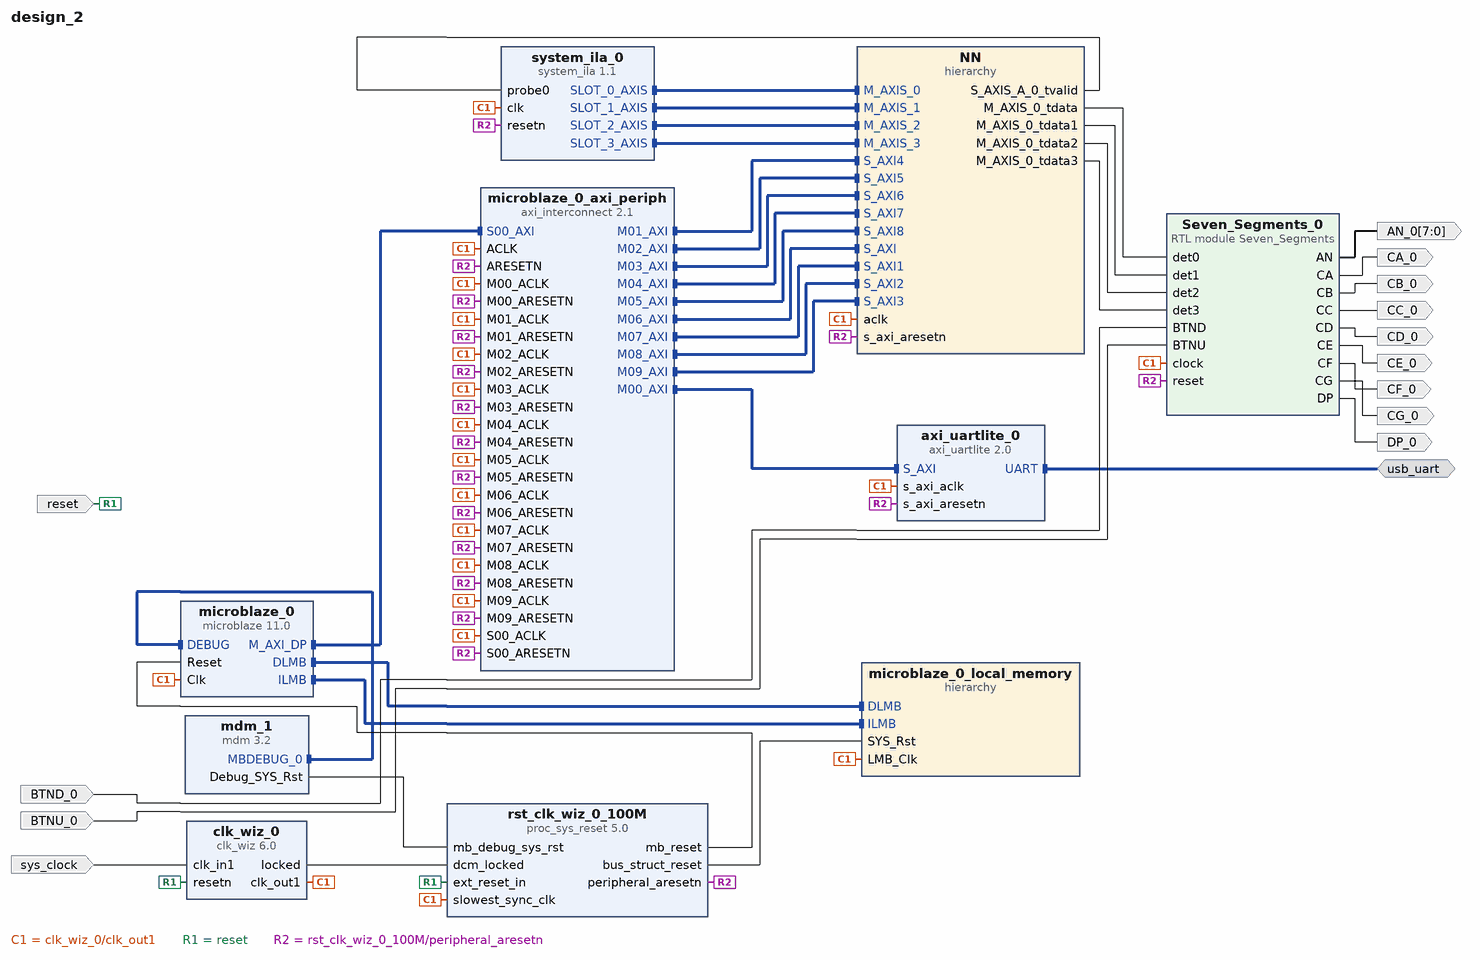
[diagram p0: block diagram of the top level]
# Vivado block design design_2, xc7a100tcsg324-1, Vivado 2021.2
create_bd_design design_2

create_bd_intf_port -mode Master -vlnv xilinx.com:interface:uart_rtl:1.0 usb_uart
create_bd_port -dir I -type clk sys_clock
set_property -dict {CONFIG.FREQ_HZ 100000000 CONFIG.PHASE 0.0} [get_bd_ports sys_clock]
create_bd_port -dir I -type rst reset
set_property -dict {CONFIG.POLARITY ACTIVE_LOW} [get_bd_ports reset]
create_bd_port -dir I BTND_0
create_bd_port -dir I BTNU_0
create_bd_port -dir O CA_0
create_bd_port -dir O DP_0
create_bd_port -dir O CG_0
create_bd_port -dir O CD_0
create_bd_port -dir O CC_0
create_bd_port -dir O CF_0
create_bd_port -dir O CE_0
create_bd_port -dir O CB_0
create_bd_port -dir O -from 7 -to 0 AN_0

create_bd_cell -type ip -vlnv xilinx.com:ip:axi_uartlite:2.0 axi_uartlite_0
set_property -dict [list \
  CONFIG.C_BAUDRATE 115200 \
  CONFIG.UARTLITE_BOARD_INTERFACE usb_uart \
  CONFIG.USE_BOARD_FLOW true \
] [get_bd_cells axi_uartlite_0]
create_bd_cell -type ip -vlnv xilinx.com:ip:clk_wiz:6.0 clk_wiz_0
set_property -dict [list \
  CONFIG.CLKOUT1_JITTER 130.958 \
  CONFIG.CLKOUT1_PHASE_ERROR 98.575 \
  CONFIG.CLKOUT1_REQUESTED_OUT_FREQ 100.000 \
  CONFIG.CLK_IN1_BOARD_INTERFACE sys_clock \
  CONFIG.MMCM_CLKFBOUT_MULT_F 10.000 \
  CONFIG.MMCM_CLKOUT0_DIVIDE_F 10.000 \
  CONFIG.MMCM_DIVCLK_DIVIDE 1 \
  CONFIG.RESET_BOARD_INTERFACE reset \
  CONFIG.RESET_PORT resetn \
  CONFIG.RESET_TYPE ACTIVE_LOW \
  CONFIG.USE_BOARD_FLOW true \
] [get_bd_cells clk_wiz_0]
create_bd_cell -type ip -vlnv xilinx.com:ip:microblaze:11.0 microblaze_0
set_property -dict {CONFIG.C_DEBUG_ENABLED 1 CONFIG.C_D_AXI 1 CONFIG.C_D_LMB 1 CONFIG.C_I_LMB 1} [get_bd_cells microblaze_0]
create_bd_cell -type hier microblaze_0_local_memory
create_bd_cell -type ip -vlnv xilinx.com:ip:mdm:3.2 mdm_1
create_bd_cell -type ip -vlnv xilinx.com:ip:proc_sys_reset:5.0 rst_clk_wiz_0_100M
set_property -dict {CONFIG.RESET_BOARD_INTERFACE reset CONFIG.USE_BOARD_FLOW true} [get_bd_cells rst_clk_wiz_0_100M]
create_bd_cell -type ip -vlnv xilinx.com:ip:axi_interconnect:2.1 microblaze_0_axi_periph
set_property -dict {CONFIG.NUM_MI 10} [get_bd_cells microblaze_0_axi_periph]
create_bd_cell -type ip -vlnv xilinx.com:ip:system_ila:1.1 system_ila_0
set_property -dict [list \
  CONFIG.C_MON_TYPE MIX \
  CONFIG.C_NUM_MONITOR_SLOTS 4 \
  CONFIG.C_NUM_OF_PROBES 1 \
  CONFIG.C_PROBE0_TYPE 0 \
  CONFIG.C_SLOT_0_APC_EN 0 \
  CONFIG.C_SLOT_0_AXI_DATA_SEL 1 \
  CONFIG.C_SLOT_0_AXI_TRIG_SEL 1 \
  CONFIG.C_SLOT_0_INTF_TYPE xilinx.com:interface:axis_rtl:1.0 \
  CONFIG.C_SLOT_1_APC_EN 0 \
  CONFIG.C_SLOT_1_AXI_DATA_SEL 1 \
  CONFIG.C_SLOT_1_AXI_TRIG_SEL 1 \
  CONFIG.C_SLOT_1_INTF_TYPE xilinx.com:interface:axis_rtl:1.0 \
  CONFIG.C_SLOT_2_APC_EN 0 \
  CONFIG.C_SLOT_2_AXI_DATA_SEL 1 \
  CONFIG.C_SLOT_2_AXI_TRIG_SEL 1 \
  CONFIG.C_SLOT_2_INTF_TYPE xilinx.com:interface:axis_rtl:1.0 \
  CONFIG.C_SLOT_3_APC_EN 0 \
  CONFIG.C_SLOT_3_AXI_DATA_SEL 1 \
  CONFIG.C_SLOT_3_AXI_TRIG_SEL 1 \
  CONFIG.C_SLOT_3_INTF_TYPE xilinx.com:interface:axis_rtl:1.0 \
] [get_bd_cells system_ila_0]
create_bd_cell -type module -reference Seven_Segments Seven_Segments_0
create_bd_cell -type hier NN

# ---- hierarchy /microblaze_0_local_memory ----
current_bd_instance /microblaze_0_local_memory
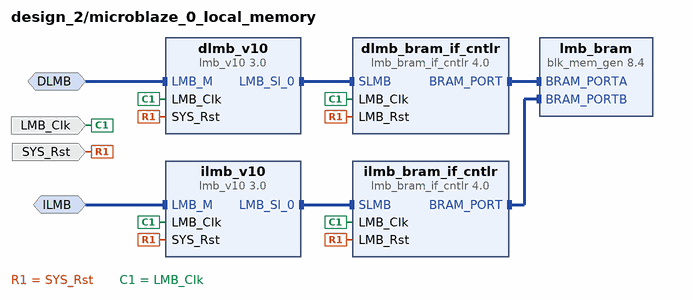
[diagram p1: block diagram inside /microblaze_0_local_memory]
create_bd_intf_pin -mode MirroredMaster -vlnv xilinx.com:interface:lmb_rtl:1.0 DLMB
create_bd_intf_pin -mode MirroredMaster -vlnv xilinx.com:interface:lmb_rtl:1.0 ILMB
create_bd_pin -dir I -type clk LMB_Clk
create_bd_pin -dir I -type rst SYS_Rst

create_bd_cell -type ip -vlnv xilinx.com:ip:lmb_v10:3.0 dlmb_v10
create_bd_cell -type ip -vlnv xilinx.com:ip:lmb_v10:3.0 ilmb_v10
create_bd_cell -type ip -vlnv xilinx.com:ip:lmb_bram_if_cntlr:4.0 dlmb_bram_if_cntlr
set_property -dict {CONFIG.C_ECC 0} [get_bd_cells dlmb_bram_if_cntlr]
create_bd_cell -type ip -vlnv xilinx.com:ip:lmb_bram_if_cntlr:4.0 ilmb_bram_if_cntlr
set_property -dict {CONFIG.C_ECC 0} [get_bd_cells ilmb_bram_if_cntlr]
create_bd_cell -type ip -vlnv xilinx.com:ip:blk_mem_gen:8.4 lmb_bram
set_property -dict {CONFIG.Memory_Type True_Dual_Port_RAM CONFIG.use_bram_block BRAM_Controller} [get_bd_cells lmb_bram]

# ---- hierarchy /NN ----
current_bd_instance /NN
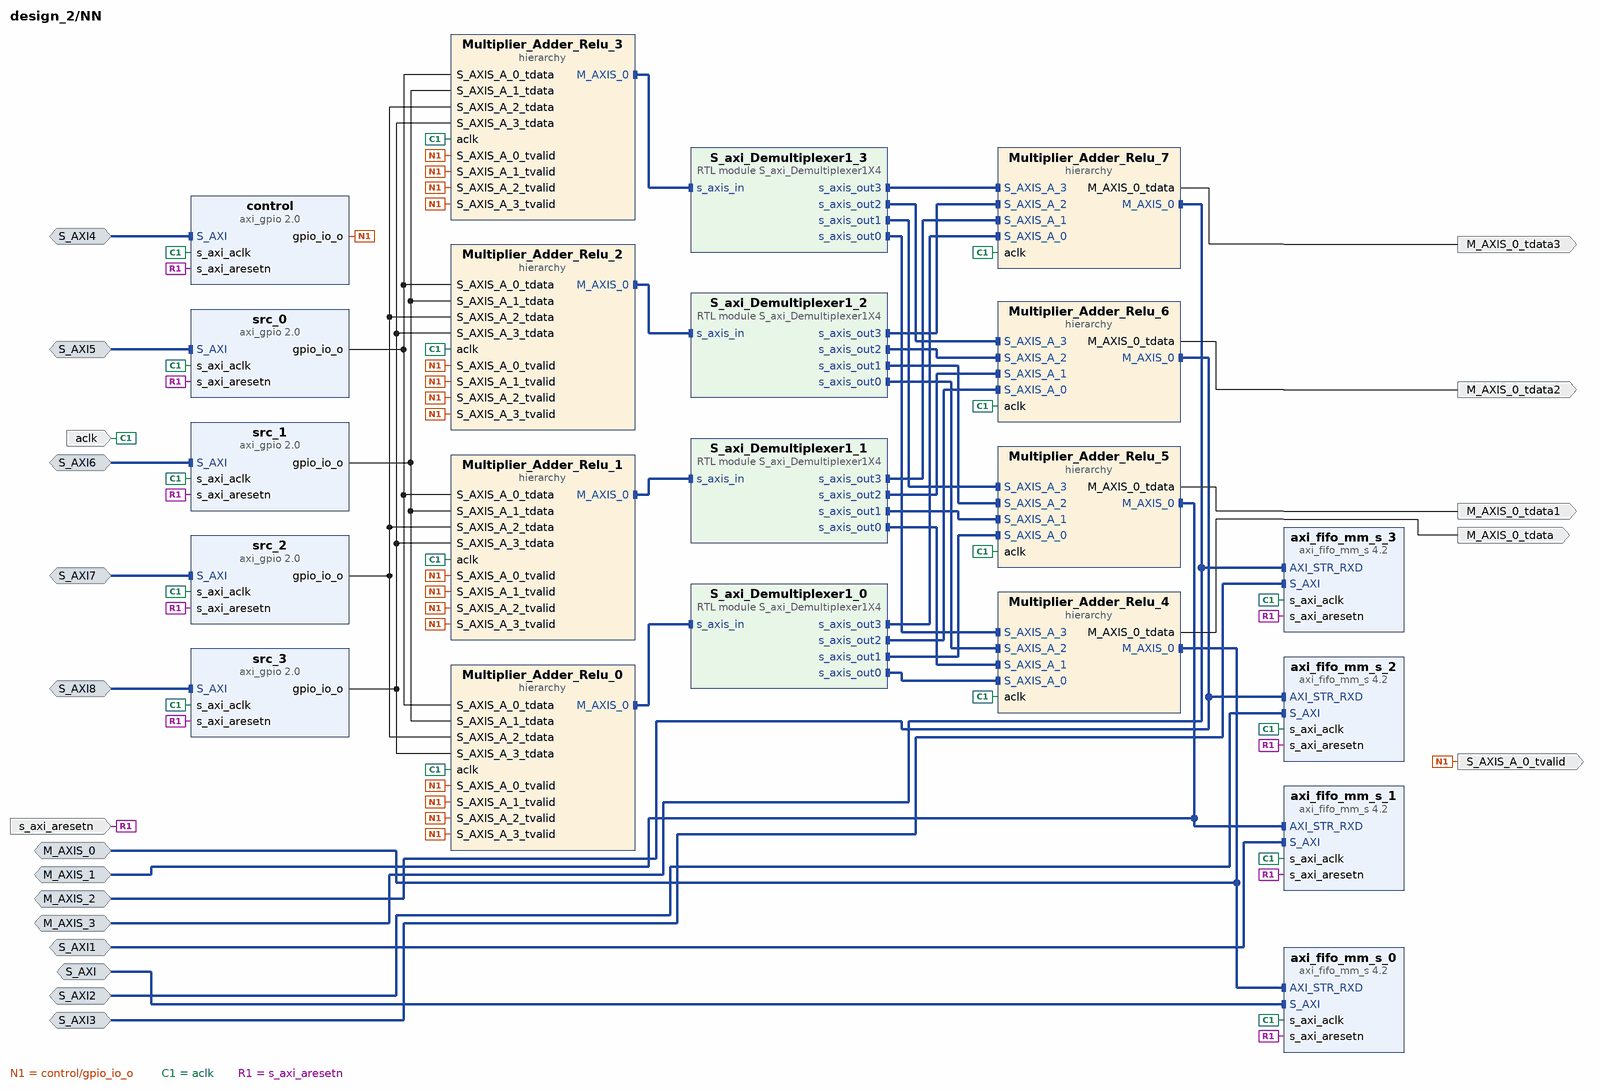
[diagram p2: block diagram inside /NN]
create_bd_intf_pin -mode Slave -vlnv xilinx.com:interface:aximm_rtl:1.0 S_AXI
create_bd_intf_pin -mode Monitor -vlnv xilinx.com:interface:axis_rtl:1.0 M_AXIS_0
create_bd_intf_pin -mode Slave -vlnv xilinx.com:interface:aximm_rtl:1.0 S_AXI1
create_bd_intf_pin -mode Monitor -vlnv xilinx.com:interface:axis_rtl:1.0 M_AXIS_1
create_bd_intf_pin -mode Slave -vlnv xilinx.com:interface:aximm_rtl:1.0 S_AXI2
create_bd_intf_pin -mode Monitor -vlnv xilinx.com:interface:axis_rtl:1.0 M_AXIS_2
create_bd_intf_pin -mode Slave -vlnv xilinx.com:interface:aximm_rtl:1.0 S_AXI3
create_bd_intf_pin -mode Monitor -vlnv xilinx.com:interface:axis_rtl:1.0 M_AXIS_3
create_bd_intf_pin -mode Slave -vlnv xilinx.com:interface:aximm_rtl:1.0 S_AXI4
create_bd_intf_pin -mode Slave -vlnv xilinx.com:interface:aximm_rtl:1.0 S_AXI5
create_bd_intf_pin -mode Slave -vlnv xilinx.com:interface:aximm_rtl:1.0 S_AXI6
create_bd_intf_pin -mode Slave -vlnv xilinx.com:interface:aximm_rtl:1.0 S_AXI7
create_bd_intf_pin -mode Slave -vlnv xilinx.com:interface:aximm_rtl:1.0 S_AXI8
create_bd_pin -dir I -type clk aclk
create_bd_pin -dir I -type rst s_axi_aresetn
create_bd_pin -dir O S_AXIS_A_0_tvalid
create_bd_pin -dir O M_AXIS_0_tdata
create_bd_pin -dir O M_AXIS_0_tdata1
create_bd_pin -dir O M_AXIS_0_tdata2
create_bd_pin -dir O M_AXIS_0_tdata3

create_bd_cell -type ip -vlnv xilinx.com:ip:axi_fifo_mm_s:4.2 axi_fifo_mm_s_0
set_property -dict {CONFIG.C_DATA_INTERFACE_TYPE 0 CONFIG.C_USE_TX_CTRL 0 CONFIG.C_USE_TX_DATA 0} [get_bd_cells axi_fifo_mm_s_0]
create_bd_cell -type ip -vlnv xilinx.com:ip:axi_fifo_mm_s:4.2 axi_fifo_mm_s_1
set_property -dict {CONFIG.C_DATA_INTERFACE_TYPE 0 CONFIG.C_USE_TX_CTRL 0 CONFIG.C_USE_TX_DATA 0} [get_bd_cells axi_fifo_mm_s_1]
create_bd_cell -type ip -vlnv xilinx.com:ip:axi_fifo_mm_s:4.2 axi_fifo_mm_s_2
set_property -dict {CONFIG.C_DATA_INTERFACE_TYPE 0 CONFIG.C_USE_TX_CTRL 0 CONFIG.C_USE_TX_DATA 0} [get_bd_cells axi_fifo_mm_s_2]
create_bd_cell -type ip -vlnv xilinx.com:ip:axi_fifo_mm_s:4.2 axi_fifo_mm_s_3
set_property -dict {CONFIG.C_DATA_INTERFACE_TYPE 0 CONFIG.C_USE_TX_CTRL 0 CONFIG.C_USE_TX_DATA 0} [get_bd_cells axi_fifo_mm_s_3]
create_bd_cell -type ip -vlnv xilinx.com:ip:axi_gpio:2.0 control
set_property -dict {CONFIG.C_ALL_OUTPUTS 1 CONFIG.C_GPIO_WIDTH 1} [get_bd_cells control]
create_bd_cell -type module -reference S_axi_Demultiplexer1X4 S_axi_Demultiplexer1_0
create_bd_cell -type module -reference S_axi_Demultiplexer1X4 S_axi_Demultiplexer1_1
create_bd_cell -type module -reference S_axi_Demultiplexer1X4 S_axi_Demultiplexer1_2
create_bd_cell -type module -reference S_axi_Demultiplexer1X4 S_axi_Demultiplexer1_3
create_bd_cell -type ip -vlnv xilinx.com:ip:axi_gpio:2.0 src_0
set_property -dict {CONFIG.C_ALL_OUTPUTS 1} [get_bd_cells src_0]
create_bd_cell -type ip -vlnv xilinx.com:ip:axi_gpio:2.0 src_1
set_property -dict {CONFIG.C_ALL_OUTPUTS 1} [get_bd_cells src_1]
create_bd_cell -type ip -vlnv xilinx.com:ip:axi_gpio:2.0 src_2
set_property -dict {CONFIG.C_ALL_OUTPUTS 1} [get_bd_cells src_2]
create_bd_cell -type ip -vlnv xilinx.com:ip:axi_gpio:2.0 src_3
set_property -dict {CONFIG.C_ALL_OUTPUTS 1} [get_bd_cells src_3]
create_bd_cell -type hier Multiplier_Adder_Relu_0
create_bd_cell -type hier Multiplier_Adder_Relu_1
create_bd_cell -type hier Multiplier_Adder_Relu_2
create_bd_cell -type hier Multiplier_Adder_Relu_3
create_bd_cell -type hier Multiplier_Adder_Relu_4
create_bd_cell -type hier Multiplier_Adder_Relu_5
create_bd_cell -type hier Multiplier_Adder_Relu_6
create_bd_cell -type hier Multiplier_Adder_Relu_7

# ---- hierarchy /NN/Multiplier_Adder_Relu_0 ----
current_bd_instance /NN/Multiplier_Adder_Relu_0
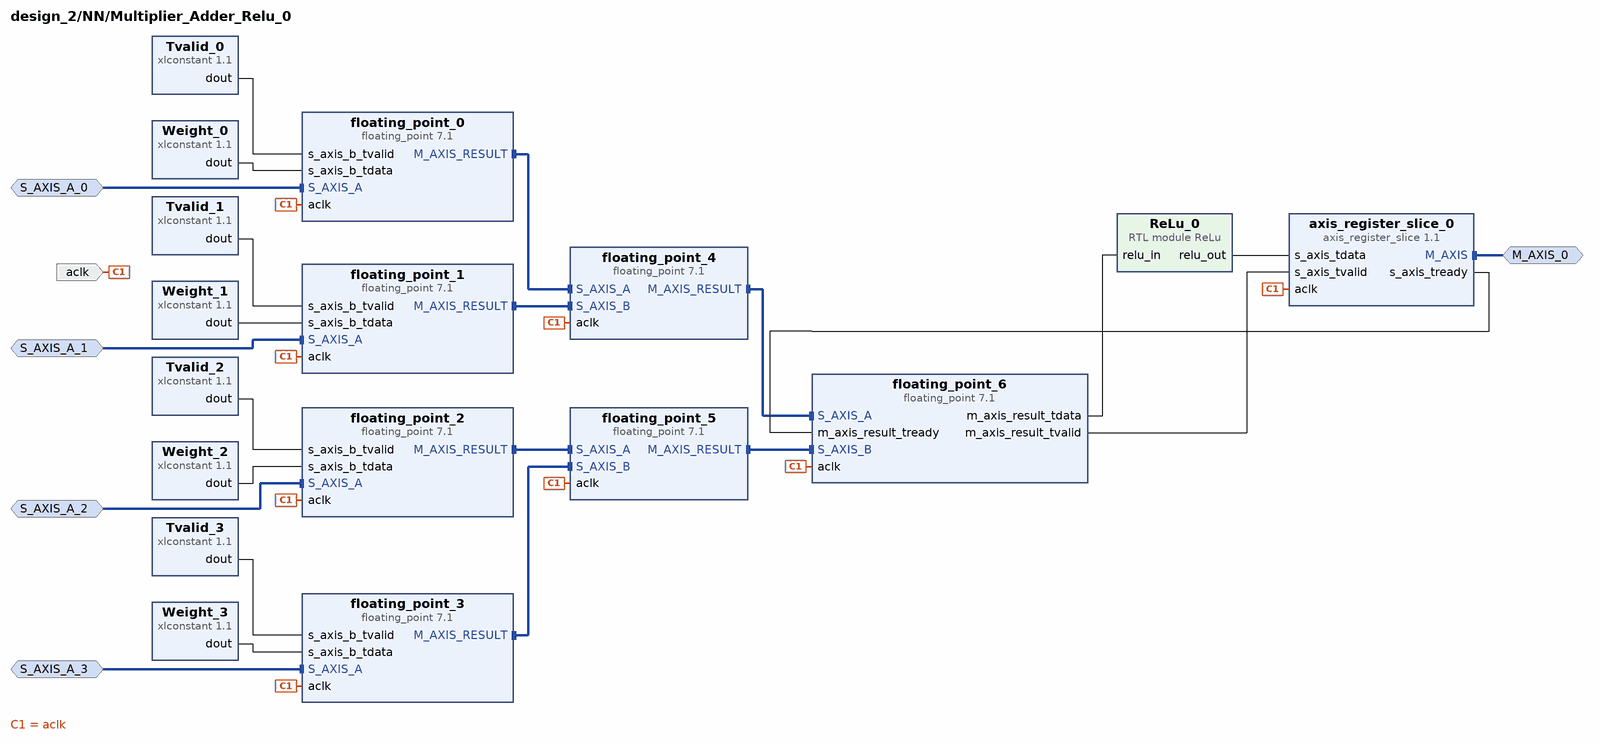
[diagram p3: block diagram inside /NN/Multiplier_Adder_Relu_0]
create_bd_intf_pin -mode Master -vlnv xilinx.com:interface:axis_rtl:1.0 M_AXIS_0
create_bd_intf_pin -mode Slave -vlnv xilinx.com:interface:axis_rtl:1.0 S_AXIS_A_0
create_bd_intf_pin -mode Slave -vlnv xilinx.com:interface:axis_rtl:1.0 S_AXIS_A_1
create_bd_intf_pin -mode Slave -vlnv xilinx.com:interface:axis_rtl:1.0 S_AXIS_A_2
create_bd_intf_pin -mode Slave -vlnv xilinx.com:interface:axis_rtl:1.0 S_AXIS_A_3
create_bd_pin -dir I -type clk aclk

create_bd_cell -type ip -vlnv xilinx.com:ip:floating_point:7.1 floating_point_2
set_property -dict [list \
  CONFIG.C_Latency 9 \
  CONFIG.C_Mult_Usage Full_Usage \
  CONFIG.C_Rate 1 \
  CONFIG.C_Result_Exponent_Width 8 \
  CONFIG.C_Result_Fraction_Width 24 \
  CONFIG.Maximum_Latency false \
  CONFIG.Operation_Type Multiply \
  CONFIG.Result_Precision_Type Single \
] [get_bd_cells floating_point_2]
create_bd_cell -type ip -vlnv xilinx.com:ip:floating_point:7.1 floating_point_3
set_property -dict [list \
  CONFIG.C_Latency 9 \
  CONFIG.C_Mult_Usage Full_Usage \
  CONFIG.C_Rate 1 \
  CONFIG.C_Result_Exponent_Width 8 \
  CONFIG.C_Result_Fraction_Width 24 \
  CONFIG.Maximum_Latency true \
  CONFIG.Operation_Type Multiply \
  CONFIG.Result_Precision_Type Single \
] [get_bd_cells floating_point_3]
create_bd_cell -type ip -vlnv xilinx.com:ip:floating_point:7.1 floating_point_0
set_property -dict [list \
  CONFIG.C_Latency 9 \
  CONFIG.C_Mult_Usage Full_Usage \
  CONFIG.C_Rate 1 \
  CONFIG.C_Result_Exponent_Width 8 \
  CONFIG.C_Result_Fraction_Width 24 \
  CONFIG.Has_ARESETn false \
  CONFIG.Has_B_TLAST false \
  CONFIG.Maximum_Latency true \
  CONFIG.Operation_Type Multiply \
  CONFIG.RESULT_TLAST_Behv Null \
  CONFIG.Result_Precision_Type Single \
] [get_bd_cells floating_point_0]
create_bd_cell -type ip -vlnv xilinx.com:ip:floating_point:7.1 floating_point_1
set_property -dict [list \
  CONFIG.C_Latency 9 \
  CONFIG.C_Mult_Usage Full_Usage \
  CONFIG.C_Rate 1 \
  CONFIG.C_Result_Exponent_Width 8 \
  CONFIG.C_Result_Fraction_Width 24 \
  CONFIG.Maximum_Latency true \
  CONFIG.Operation_Type Multiply \
  CONFIG.Result_Precision_Type Single \
] [get_bd_cells floating_point_1]
create_bd_cell -type ip -vlnv xilinx.com:ip:floating_point:7.1 floating_point_4
set_property -dict [list \
  CONFIG.Add_Sub_Value Add \
  CONFIG.C_Latency 12 \
  CONFIG.C_Mult_Usage Full_Usage \
  CONFIG.C_Rate 1 \
  CONFIG.C_Result_Exponent_Width 8 \
  CONFIG.C_Result_Fraction_Width 24 \
  CONFIG.Maximum_Latency true \
  CONFIG.Operation_Type Add_Subtract \
  CONFIG.Result_Precision_Type Single \
] [get_bd_cells floating_point_4]
create_bd_cell -type ip -vlnv xilinx.com:ip:floating_point:7.1 floating_point_5
set_property -dict [list \
  CONFIG.Add_Sub_Value Add \
  CONFIG.C_Latency 12 \
  CONFIG.C_Mult_Usage Full_Usage \
  CONFIG.C_Rate 1 \
  CONFIG.C_Result_Exponent_Width 8 \
  CONFIG.C_Result_Fraction_Width 24 \
  CONFIG.Maximum_Latency true \
  CONFIG.Operation_Type Add_Subtract \
  CONFIG.Result_Precision_Type Single \
] [get_bd_cells floating_point_5]
create_bd_cell -type ip -vlnv xilinx.com:ip:floating_point:7.1 floating_point_6
set_property -dict [list \
  CONFIG.Add_Sub_Value Add \
  CONFIG.C_Latency 12 \
  CONFIG.C_Mult_Usage Full_Usage \
  CONFIG.C_Rate 1 \
  CONFIG.C_Result_Exponent_Width 8 \
  CONFIG.C_Result_Fraction_Width 24 \
  CONFIG.Maximum_Latency true \
  CONFIG.Operation_Type Add_Subtract \
  CONFIG.Result_Precision_Type Single \
] [get_bd_cells floating_point_6]
create_bd_cell -type ip -vlnv xilinx.com:ip:xlconstant:1.1 Weight_0
set_property -dict {CONFIG.CONST_VAL b00111111000100101011111101110100 CONFIG.CONST_WIDTH 32} [get_bd_cells Weight_0]
create_bd_cell -type ip -vlnv xilinx.com:ip:xlconstant:1.1 Weight_1
set_property -dict {CONFIG.CONST_VAL b01000000001010000111001011011000 CONFIG.CONST_WIDTH 32} [get_bd_cells Weight_1]
create_bd_cell -type ip -vlnv xilinx.com:ip:xlconstant:1.1 Weight_2
set_property -dict {CONFIG.CONST_VAL b10111111101001111100111011001100 CONFIG.CONST_WIDTH 32} [get_bd_cells Weight_2]
create_bd_cell -type ip -vlnv xilinx.com:ip:xlconstant:1.1 Weight_3
set_property -dict {CONFIG.CONST_VAL b00111111001101111000001001101100 CONFIG.CONST_WIDTH 32} [get_bd_cells Weight_3]
create_bd_cell -type ip -vlnv xilinx.com:ip:axis_register_slice:1.1 axis_register_slice_0
set_property -dict {CONFIG.TDATA_NUM_BYTES 4} [get_bd_cells axis_register_slice_0]
create_bd_cell -type ip -vlnv xilinx.com:ip:xlconstant:1.1 Tvalid_0
set_property -dict {CONFIG.CONST_WIDTH 1} [get_bd_cells Tvalid_0]
create_bd_cell -type ip -vlnv xilinx.com:ip:xlconstant:1.1 Tvalid_1
set_property -dict {CONFIG.CONST_WIDTH 1} [get_bd_cells Tvalid_1]
create_bd_cell -type ip -vlnv xilinx.com:ip:xlconstant:1.1 Tvalid_2
set_property -dict {CONFIG.CONST_WIDTH 1} [get_bd_cells Tvalid_2]
create_bd_cell -type ip -vlnv xilinx.com:ip:xlconstant:1.1 Tvalid_3
set_property -dict {CONFIG.CONST_WIDTH 1} [get_bd_cells Tvalid_3]
create_bd_cell -type module -reference ReLu ReLu_0

# ---- hierarchy /NN/Multiplier_Adder_Relu_1 ----
current_bd_instance /NN/Multiplier_Adder_Relu_1
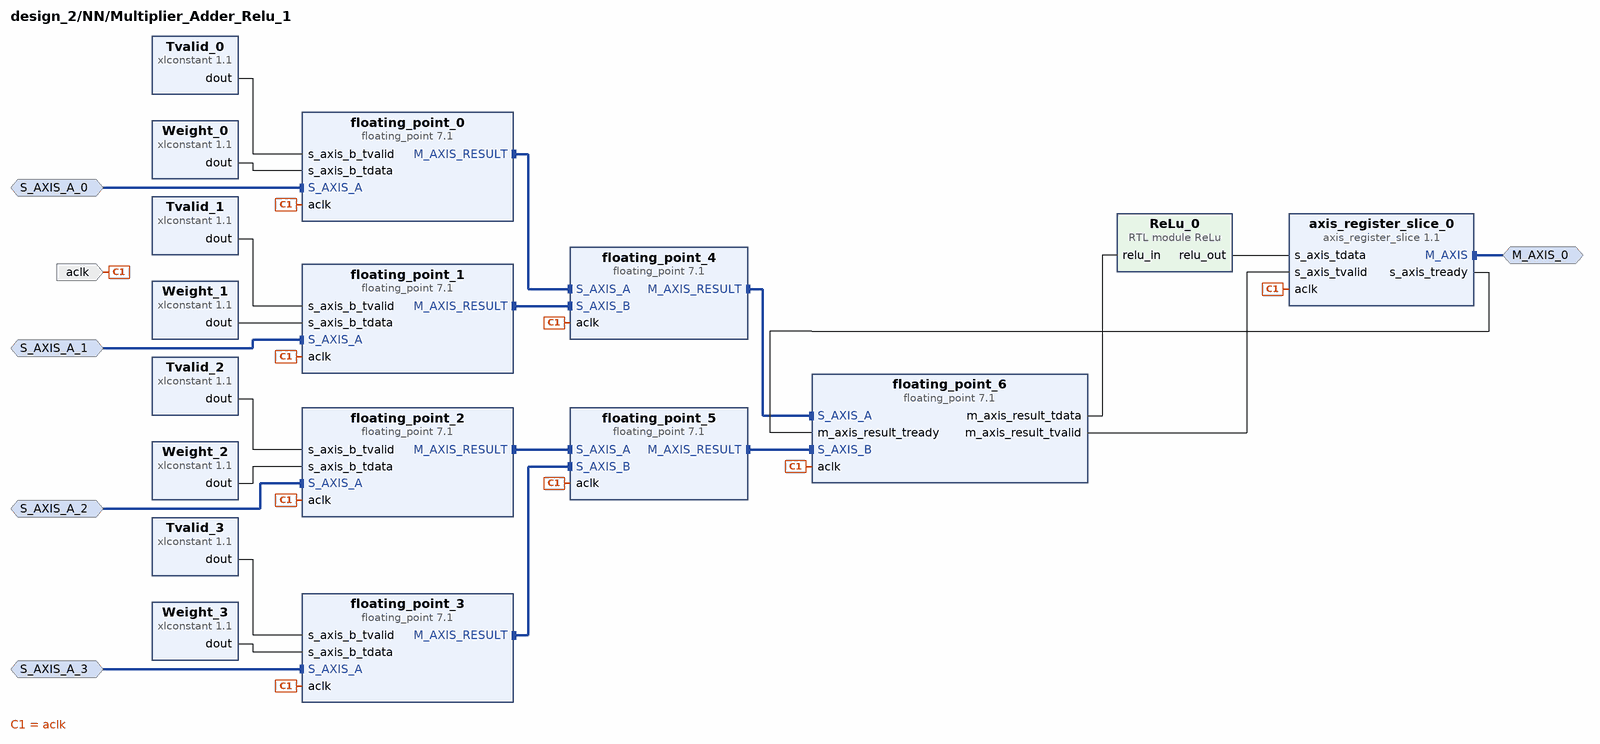
[diagram p4: block diagram inside /NN/Multiplier_Adder_Relu_1]
create_bd_intf_pin -mode Master -vlnv xilinx.com:interface:axis_rtl:1.0 M_AXIS_0
create_bd_intf_pin -mode Slave -vlnv xilinx.com:interface:axis_rtl:1.0 S_AXIS_A_0
create_bd_intf_pin -mode Slave -vlnv xilinx.com:interface:axis_rtl:1.0 S_AXIS_A_1
create_bd_intf_pin -mode Slave -vlnv xilinx.com:interface:axis_rtl:1.0 S_AXIS_A_2
create_bd_intf_pin -mode Slave -vlnv xilinx.com:interface:axis_rtl:1.0 S_AXIS_A_3
create_bd_pin -dir I -type clk aclk

create_bd_cell -type ip -vlnv xilinx.com:ip:floating_point:7.1 floating_point_2
set_property -dict [list \
  CONFIG.C_Latency 9 \
  CONFIG.C_Mult_Usage Full_Usage \
  CONFIG.C_Rate 1 \
  CONFIG.C_Result_Exponent_Width 8 \
  CONFIG.C_Result_Fraction_Width 24 \
  CONFIG.Maximum_Latency true \
  CONFIG.Operation_Type Multiply \
  CONFIG.Result_Precision_Type Single \
] [get_bd_cells floating_point_2]
create_bd_cell -type ip -vlnv xilinx.com:ip:floating_point:7.1 floating_point_3
set_property -dict [list \
  CONFIG.C_Latency 9 \
  CONFIG.C_Mult_Usage Full_Usage \
  CONFIG.C_Rate 1 \
  CONFIG.C_Result_Exponent_Width 8 \
  CONFIG.C_Result_Fraction_Width 24 \
  CONFIG.Maximum_Latency true \
  CONFIG.Operation_Type Multiply \
  CONFIG.Result_Precision_Type Single \
] [get_bd_cells floating_point_3]
create_bd_cell -type ip -vlnv xilinx.com:ip:floating_point:7.1 floating_point_0
set_property -dict [list \
  CONFIG.C_Latency 9 \
  CONFIG.C_Mult_Usage Full_Usage \
  CONFIG.C_Rate 1 \
  CONFIG.C_Result_Exponent_Width 8 \
  CONFIG.C_Result_Fraction_Width 24 \
  CONFIG.Has_ARESETn false \
  CONFIG.Has_B_TLAST false \
  CONFIG.Maximum_Latency true \
  CONFIG.Operation_Type Multiply \
  CONFIG.RESULT_TLAST_Behv Null \
  CONFIG.Result_Precision_Type Single \
] [get_bd_cells floating_point_0]
create_bd_cell -type ip -vlnv xilinx.com:ip:floating_point:7.1 floating_point_1
set_property -dict [list \
  CONFIG.C_Latency 9 \
  CONFIG.C_Mult_Usage Full_Usage \
  CONFIG.C_Rate 1 \
  CONFIG.C_Result_Exponent_Width 8 \
  CONFIG.C_Result_Fraction_Width 24 \
  CONFIG.Maximum_Latency true \
  CONFIG.Operation_Type Multiply \
  CONFIG.Result_Precision_Type Single \
] [get_bd_cells floating_point_1]
create_bd_cell -type ip -vlnv xilinx.com:ip:floating_point:7.1 floating_point_4
set_property -dict [list \
  CONFIG.Add_Sub_Value Add \
  CONFIG.C_Latency 12 \
  CONFIG.C_Mult_Usage Full_Usage \
  CONFIG.C_Rate 1 \
  CONFIG.C_Result_Exponent_Width 8 \
  CONFIG.C_Result_Fraction_Width 24 \
  CONFIG.Maximum_Latency true \
  CONFIG.Operation_Type Add_Subtract \
  CONFIG.Result_Precision_Type Single \
] [get_bd_cells floating_point_4]
create_bd_cell -type ip -vlnv xilinx.com:ip:floating_point:7.1 floating_point_5
set_property -dict [list \
  CONFIG.Add_Sub_Value Add \
  CONFIG.C_Latency 12 \
  CONFIG.C_Mult_Usage Full_Usage \
  CONFIG.C_Rate 1 \
  CONFIG.C_Result_Exponent_Width 8 \
  CONFIG.C_Result_Fraction_Width 24 \
  CONFIG.Maximum_Latency true \
  CONFIG.Operation_Type Add_Subtract \
  CONFIG.Result_Precision_Type Single \
] [get_bd_cells floating_point_5]
create_bd_cell -type ip -vlnv xilinx.com:ip:floating_point:7.1 floating_point_6
set_property -dict [list \
  CONFIG.Add_Sub_Value Add \
  CONFIG.C_Latency 12 \
  CONFIG.C_Mult_Usage Full_Usage \
  CONFIG.C_Rate 1 \
  CONFIG.C_Result_Exponent_Width 8 \
  CONFIG.C_Result_Fraction_Width 24 \
  CONFIG.Maximum_Latency true \
  CONFIG.Operation_Type Add_Subtract \
  CONFIG.Result_Precision_Type Single \
] [get_bd_cells floating_point_6]
create_bd_cell -type ip -vlnv xilinx.com:ip:xlconstant:1.1 Weight_0
set_property -dict {CONFIG.CONST_VAL b10111111101001111001101100101100 CONFIG.CONST_WIDTH 32} [get_bd_cells Weight_0]
create_bd_cell -type ip -vlnv xilinx.com:ip:xlconstant:1.1 Weight_1
set_property -dict {CONFIG.CONST_VAL b00111111110011001100001010001000 CONFIG.CONST_WIDTH 32} [get_bd_cells Weight_1]
create_bd_cell -type ip -vlnv xilinx.com:ip:xlconstant:1.1 Weight_2
set_property -dict {CONFIG.CONST_VAL b01000000001101011100101110000001 CONFIG.CONST_WIDTH 32} [get_bd_cells Weight_2]
create_bd_cell -type ip -vlnv xilinx.com:ip:xlconstant:1.1 Weight_3
set_property -dict {CONFIG.CONST_VAL b10111111110001010111101010001011 CONFIG.CONST_WIDTH 32} [get_bd_cells Weight_3]
create_bd_cell -type ip -vlnv xilinx.com:ip:axis_register_slice:1.1 axis_register_slice_0
set_property -dict {CONFIG.TDATA_NUM_BYTES 4} [get_bd_cells axis_register_slice_0]
create_bd_cell -type ip -vlnv xilinx.com:ip:xlconstant:1.1 Tvalid_0
set_property -dict {CONFIG.CONST_WIDTH 1} [get_bd_cells Tvalid_0]
create_bd_cell -type ip -vlnv xilinx.com:ip:xlconstant:1.1 Tvalid_1
set_property -dict {CONFIG.CONST_WIDTH 1} [get_bd_cells Tvalid_1]
create_bd_cell -type ip -vlnv xilinx.com:ip:xlconstant:1.1 Tvalid_2
set_property -dict {CONFIG.CONST_WIDTH 1} [get_bd_cells Tvalid_2]
create_bd_cell -type ip -vlnv xilinx.com:ip:xlconstant:1.1 Tvalid_3
set_property -dict {CONFIG.CONST_WIDTH 1} [get_bd_cells Tvalid_3]
create_bd_cell -type module -reference ReLu ReLu_0

# ---- hierarchy /NN/Multiplier_Adder_Relu_2 ----
current_bd_instance /NN/Multiplier_Adder_Relu_2
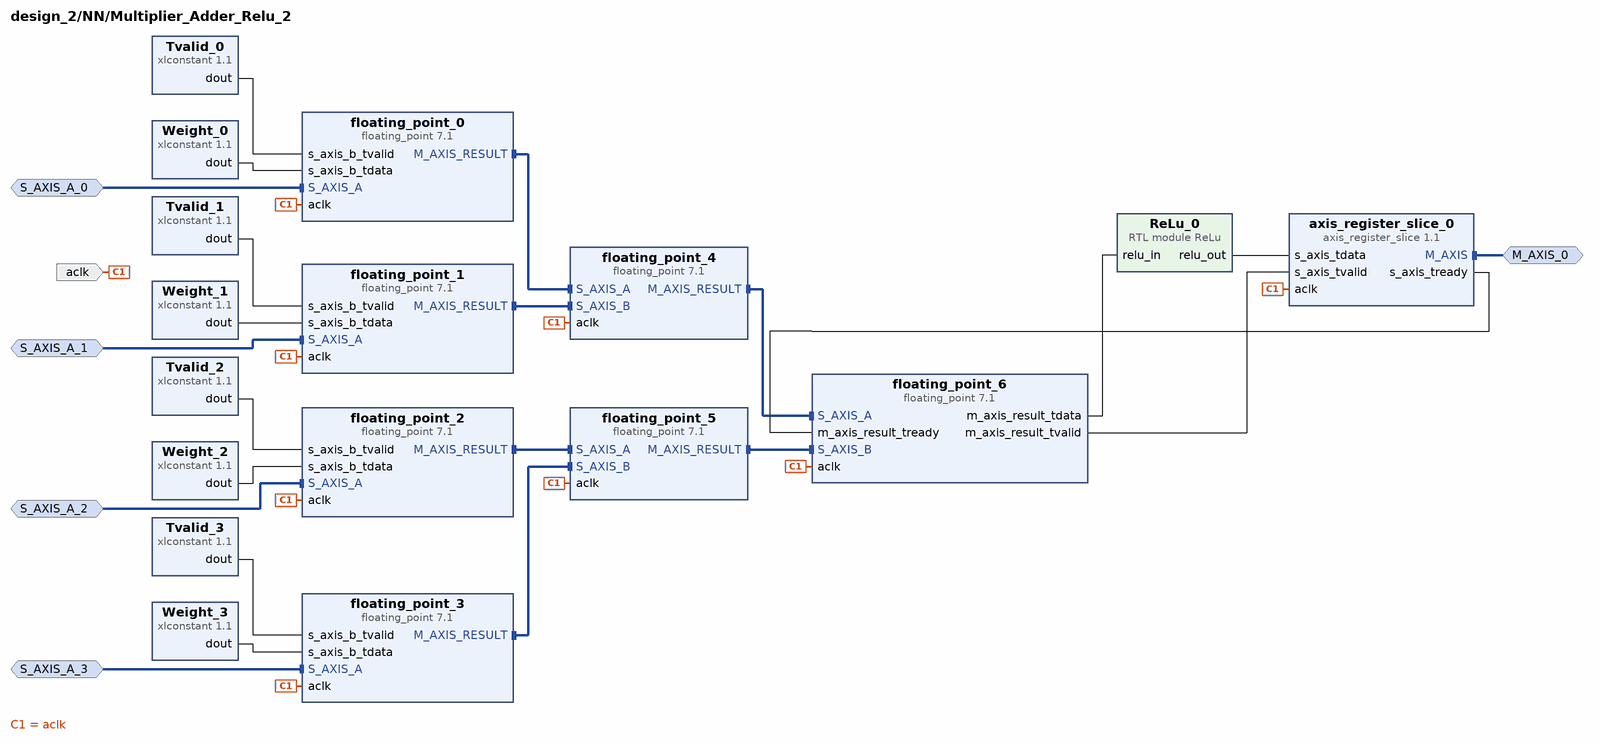
[diagram p5: block diagram inside /NN/Multiplier_Adder_Relu_2]
create_bd_intf_pin -mode Master -vlnv xilinx.com:interface:axis_rtl:1.0 M_AXIS_0
create_bd_intf_pin -mode Slave -vlnv xilinx.com:interface:axis_rtl:1.0 S_AXIS_A_0
create_bd_intf_pin -mode Slave -vlnv xilinx.com:interface:axis_rtl:1.0 S_AXIS_A_1
create_bd_intf_pin -mode Slave -vlnv xilinx.com:interface:axis_rtl:1.0 S_AXIS_A_2
create_bd_intf_pin -mode Slave -vlnv xilinx.com:interface:axis_rtl:1.0 S_AXIS_A_3
create_bd_pin -dir I -type clk aclk

create_bd_cell -type ip -vlnv xilinx.com:ip:floating_point:7.1 floating_point_2
set_property -dict [list \
  CONFIG.C_Latency 9 \
  CONFIG.C_Mult_Usage Full_Usage \
  CONFIG.C_Rate 1 \
  CONFIG.C_Result_Exponent_Width 8 \
  CONFIG.C_Result_Fraction_Width 24 \
  CONFIG.Maximum_Latency true \
  CONFIG.Operation_Type Multiply \
  CONFIG.Result_Precision_Type Single \
] [get_bd_cells floating_point_2]
create_bd_cell -type ip -vlnv xilinx.com:ip:floating_point:7.1 floating_point_3
set_property -dict [list \
  CONFIG.C_Latency 9 \
  CONFIG.C_Mult_Usage Full_Usage \
  CONFIG.C_Rate 1 \
  CONFIG.C_Result_Exponent_Width 8 \
  CONFIG.C_Result_Fraction_Width 24 \
  CONFIG.Maximum_Latency true \
  CONFIG.Operation_Type Multiply \
  CONFIG.Result_Precision_Type Single \
] [get_bd_cells floating_point_3]
create_bd_cell -type ip -vlnv xilinx.com:ip:floating_point:7.1 floating_point_0
set_property -dict [list \
  CONFIG.C_Latency 9 \
  CONFIG.C_Mult_Usage Full_Usage \
  CONFIG.C_Rate 1 \
  CONFIG.C_Result_Exponent_Width 8 \
  CONFIG.C_Result_Fraction_Width 24 \
  CONFIG.Has_ARESETn false \
  CONFIG.Has_B_TLAST false \
  CONFIG.Maximum_Latency true \
  CONFIG.Operation_Type Multiply \
  CONFIG.RESULT_TLAST_Behv Null \
  CONFIG.Result_Precision_Type Single \
] [get_bd_cells floating_point_0]
create_bd_cell -type ip -vlnv xilinx.com:ip:floating_point:7.1 floating_point_1
set_property -dict [list \
  CONFIG.C_Latency 9 \
  CONFIG.C_Mult_Usage Full_Usage \
  CONFIG.C_Rate 1 \
  CONFIG.C_Result_Exponent_Width 8 \
  CONFIG.C_Result_Fraction_Width 24 \
  CONFIG.Maximum_Latency true \
  CONFIG.Operation_Type Multiply \
  CONFIG.Result_Precision_Type Single \
] [get_bd_cells floating_point_1]
create_bd_cell -type ip -vlnv xilinx.com:ip:floating_point:7.1 floating_point_4
set_property -dict [list \
  CONFIG.Add_Sub_Value Add \
  CONFIG.C_Latency 12 \
  CONFIG.C_Mult_Usage Full_Usage \
  CONFIG.C_Rate 1 \
  CONFIG.C_Result_Exponent_Width 8 \
  CONFIG.C_Result_Fraction_Width 24 \
  CONFIG.Maximum_Latency true \
  CONFIG.Operation_Type Add_Subtract \
  CONFIG.Result_Precision_Type Single \
] [get_bd_cells floating_point_4]
create_bd_cell -type ip -vlnv xilinx.com:ip:floating_point:7.1 floating_point_5
set_property -dict [list \
  CONFIG.Add_Sub_Value Add \
  CONFIG.C_Latency 12 \
  CONFIG.C_Mult_Usage Full_Usage \
  CONFIG.C_Rate 1 \
  CONFIG.C_Result_Exponent_Width 8 \
  CONFIG.C_Result_Fraction_Width 24 \
  CONFIG.Maximum_Latency true \
  CONFIG.Operation_Type Add_Subtract \
  CONFIG.Result_Precision_Type Single \
] [get_bd_cells floating_point_5]
create_bd_cell -type ip -vlnv xilinx.com:ip:floating_point:7.1 floating_point_6
set_property -dict [list \
  CONFIG.Add_Sub_Value Add \
  CONFIG.C_Latency 12 \
  CONFIG.C_Mult_Usage Full_Usage \
  CONFIG.C_Rate 1 \
  CONFIG.C_Result_Exponent_Width 8 \
  CONFIG.C_Result_Fraction_Width 24 \
  CONFIG.Maximum_Latency true \
  CONFIG.Operation_Type Add_Subtract \
  CONFIG.Result_Precision_Type Single \
] [get_bd_cells floating_point_6]
create_bd_cell -type ip -vlnv xilinx.com:ip:xlconstant:1.1 Weight_0
set_property -dict {CONFIG.CONST_VAL b00111110001110100101010000011010 CONFIG.CONST_WIDTH 32} [get_bd_cells Weight_0]
create_bd_cell -type ip -vlnv xilinx.com:ip:xlconstant:1.1 Weight_1
set_property -dict {CONFIG.CONST_VAL b10111110101111100110011100011110 CONFIG.CONST_WIDTH 32} [get_bd_cells Weight_1]
create_bd_cell -type ip -vlnv xilinx.com:ip:xlconstant:1.1 Weight_2
set_property -dict {CONFIG.CONST_VAL b00111011111001000101001101100001 CONFIG.CONST_WIDTH 32} [get_bd_cells Weight_2]
create_bd_cell -type ip -vlnv xilinx.com:ip:xlconstant:1.1 Weight_3
set_property -dict {CONFIG.CONST_VAL b10111110100000111000011010010011 CONFIG.CONST_WIDTH 32} [get_bd_cells Weight_3]
create_bd_cell -type ip -vlnv xilinx.com:ip:axis_register_slice:1.1 axis_register_slice_0
set_property -dict {CONFIG.TDATA_NUM_BYTES 4} [get_bd_cells axis_register_slice_0]
create_bd_cell -type ip -vlnv xilinx.com:ip:xlconstant:1.1 Tvalid_0
set_property -dict {CONFIG.CONST_WIDTH 1} [get_bd_cells Tvalid_0]
create_bd_cell -type ip -vlnv xilinx.com:ip:xlconstant:1.1 Tvalid_1
set_property -dict {CONFIG.CONST_WIDTH 1} [get_bd_cells Tvalid_1]
create_bd_cell -type ip -vlnv xilinx.com:ip:xlconstant:1.1 Tvalid_2
set_property -dict {CONFIG.CONST_WIDTH 1} [get_bd_cells Tvalid_2]
create_bd_cell -type ip -vlnv xilinx.com:ip:xlconstant:1.1 Tvalid_3
set_property -dict {CONFIG.CONST_WIDTH 1} [get_bd_cells Tvalid_3]
create_bd_cell -type module -reference ReLu ReLu_0

# ---- hierarchy /NN/Multiplier_Adder_Relu_3 ----
current_bd_instance /NN/Multiplier_Adder_Relu_3
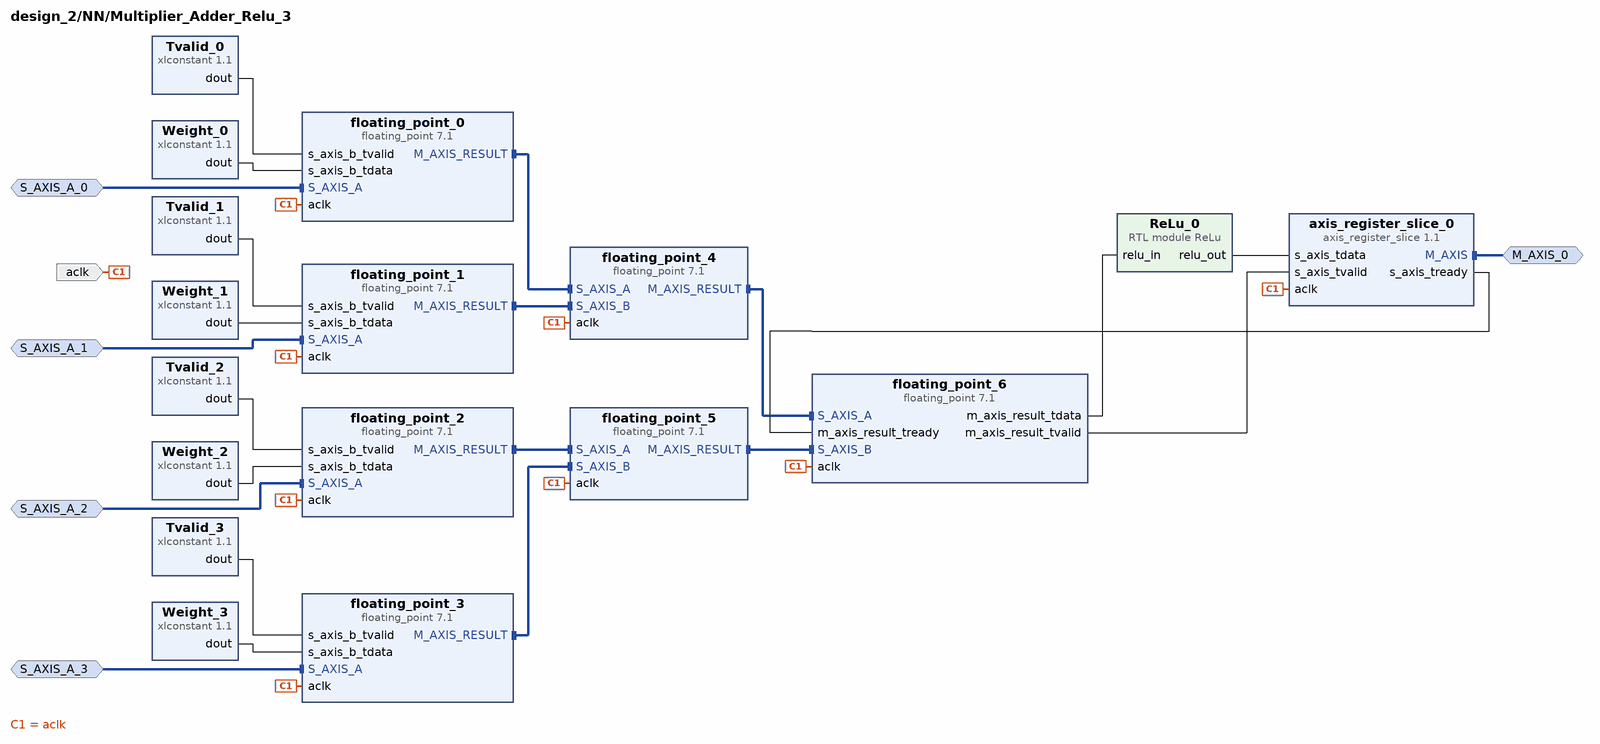
[diagram p6: block diagram inside /NN/Multiplier_Adder_Relu_3]
create_bd_intf_pin -mode Master -vlnv xilinx.com:interface:axis_rtl:1.0 M_AXIS_0
create_bd_intf_pin -mode Slave -vlnv xilinx.com:interface:axis_rtl:1.0 S_AXIS_A_0
create_bd_intf_pin -mode Slave -vlnv xilinx.com:interface:axis_rtl:1.0 S_AXIS_A_1
create_bd_intf_pin -mode Slave -vlnv xilinx.com:interface:axis_rtl:1.0 S_AXIS_A_2
create_bd_intf_pin -mode Slave -vlnv xilinx.com:interface:axis_rtl:1.0 S_AXIS_A_3
create_bd_pin -dir I -type clk aclk

create_bd_cell -type ip -vlnv xilinx.com:ip:floating_point:7.1 floating_point_2
set_property -dict [list \
  CONFIG.C_Latency 9 \
  CONFIG.C_Mult_Usage Full_Usage \
  CONFIG.C_Rate 1 \
  CONFIG.C_Result_Exponent_Width 8 \
  CONFIG.C_Result_Fraction_Width 24 \
  CONFIG.Maximum_Latency true \
  CONFIG.Operation_Type Multiply \
  CONFIG.Result_Precision_Type Single \
] [get_bd_cells floating_point_2]
create_bd_cell -type ip -vlnv xilinx.com:ip:floating_point:7.1 floating_point_3
set_property -dict [list \
  CONFIG.C_Latency 9 \
  CONFIG.C_Mult_Usage Full_Usage \
  CONFIG.C_Rate 1 \
  CONFIG.C_Result_Exponent_Width 8 \
  CONFIG.C_Result_Fraction_Width 24 \
  CONFIG.Maximum_Latency true \
  CONFIG.Operation_Type Multiply \
  CONFIG.Result_Precision_Type Single \
] [get_bd_cells floating_point_3]
create_bd_cell -type ip -vlnv xilinx.com:ip:floating_point:7.1 floating_point_0
set_property -dict [list \
  CONFIG.C_Latency 9 \
  CONFIG.C_Mult_Usage Full_Usage \
  CONFIG.C_Rate 1 \
  CONFIG.C_Result_Exponent_Width 8 \
  CONFIG.C_Result_Fraction_Width 24 \
  CONFIG.Has_ARESETn false \
  CONFIG.Has_B_TLAST false \
  CONFIG.Maximum_Latency true \
  CONFIG.Operation_Type Multiply \
  CONFIG.RESULT_TLAST_Behv Null \
  CONFIG.Result_Precision_Type Single \
] [get_bd_cells floating_point_0]
create_bd_cell -type ip -vlnv xilinx.com:ip:floating_point:7.1 floating_point_1
set_property -dict [list \
  CONFIG.C_Latency 9 \
  CONFIG.C_Mult_Usage Full_Usage \
  CONFIG.C_Rate 1 \
  CONFIG.C_Result_Exponent_Width 8 \
  CONFIG.C_Result_Fraction_Width 24 \
  CONFIG.Maximum_Latency true \
  CONFIG.Operation_Type Multiply \
  CONFIG.Result_Precision_Type Single \
] [get_bd_cells floating_point_1]
create_bd_cell -type ip -vlnv xilinx.com:ip:floating_point:7.1 floating_point_4
set_property -dict [list \
  CONFIG.Add_Sub_Value Add \
  CONFIG.C_Latency 12 \
  CONFIG.C_Mult_Usage Full_Usage \
  CONFIG.C_Rate 1 \
  CONFIG.C_Result_Exponent_Width 8 \
  CONFIG.C_Result_Fraction_Width 24 \
  CONFIG.Maximum_Latency true \
  CONFIG.Operation_Type Add_Subtract \
  CONFIG.Result_Precision_Type Single \
] [get_bd_cells floating_point_4]
create_bd_cell -type ip -vlnv xilinx.com:ip:floating_point:7.1 floating_point_5
set_property -dict [list \
  CONFIG.Add_Sub_Value Add \
  CONFIG.C_Latency 12 \
  CONFIG.C_Mult_Usage Full_Usage \
  CONFIG.C_Rate 1 \
  CONFIG.C_Result_Exponent_Width 8 \
  CONFIG.C_Result_Fraction_Width 24 \
  CONFIG.Maximum_Latency true \
  CONFIG.Operation_Type Add_Subtract \
  CONFIG.Result_Precision_Type Single \
] [get_bd_cells floating_point_5]
create_bd_cell -type ip -vlnv xilinx.com:ip:floating_point:7.1 floating_point_6
set_property -dict [list \
  CONFIG.Add_Sub_Value Add \
  CONFIG.C_Latency 12 \
  CONFIG.C_Mult_Usage Full_Usage \
  CONFIG.C_Rate 1 \
  CONFIG.C_Result_Exponent_Width 8 \
  CONFIG.C_Result_Fraction_Width 24 \
  CONFIG.Maximum_Latency true \
  CONFIG.Operation_Type Add_Subtract \
  CONFIG.Result_Precision_Type Single \
] [get_bd_cells floating_point_6]
create_bd_cell -type ip -vlnv xilinx.com:ip:xlconstant:1.1 Weight_0
set_property -dict {CONFIG.CONST_VAL b00111110001100100101110010100011 CONFIG.CONST_WIDTH 32} [get_bd_cells Weight_0]
create_bd_cell -type ip -vlnv xilinx.com:ip:xlconstant:1.1 Weight_1
set_property -dict {CONFIG.CONST_VAL b00111100010010111001010111000001 CONFIG.CONST_WIDTH 32} [get_bd_cells Weight_1]
create_bd_cell -type ip -vlnv xilinx.com:ip:xlconstant:1.1 Weight_2
set_property -dict {CONFIG.CONST_VAL b10111111110110110001101001100110 CONFIG.CONST_WIDTH 32} [get_bd_cells Weight_2]
create_bd_cell -type ip -vlnv xilinx.com:ip:xlconstant:1.1 Weight_3
set_property -dict {CONFIG.CONST_VAL b01000000000011000010110001001001 CONFIG.CONST_WIDTH 32} [get_bd_cells Weight_3]
create_bd_cell -type ip -vlnv xilinx.com:ip:axis_register_slice:1.1 axis_register_slice_0
set_property -dict {CONFIG.TDATA_NUM_BYTES 4} [get_bd_cells axis_register_slice_0]
create_bd_cell -type ip -vlnv xilinx.com:ip:xlconstant:1.1 Tvalid_0
set_property -dict {CONFIG.CONST_WIDTH 1} [get_bd_cells Tvalid_0]
create_bd_cell -type ip -vlnv xilinx.com:ip:xlconstant:1.1 Tvalid_1
set_property -dict {CONFIG.CONST_WIDTH 1} [get_bd_cells Tvalid_1]
create_bd_cell -type ip -vlnv xilinx.com:ip:xlconstant:1.1 Tvalid_2
set_property -dict {CONFIG.CONST_WIDTH 1} [get_bd_cells Tvalid_2]
create_bd_cell -type ip -vlnv xilinx.com:ip:xlconstant:1.1 Tvalid_3
set_property -dict {CONFIG.CONST_WIDTH 1} [get_bd_cells Tvalid_3]
create_bd_cell -type module -reference ReLu ReLu_0

# ---- hierarchy /NN/Multiplier_Adder_Relu_4 ----
current_bd_instance /NN/Multiplier_Adder_Relu_4
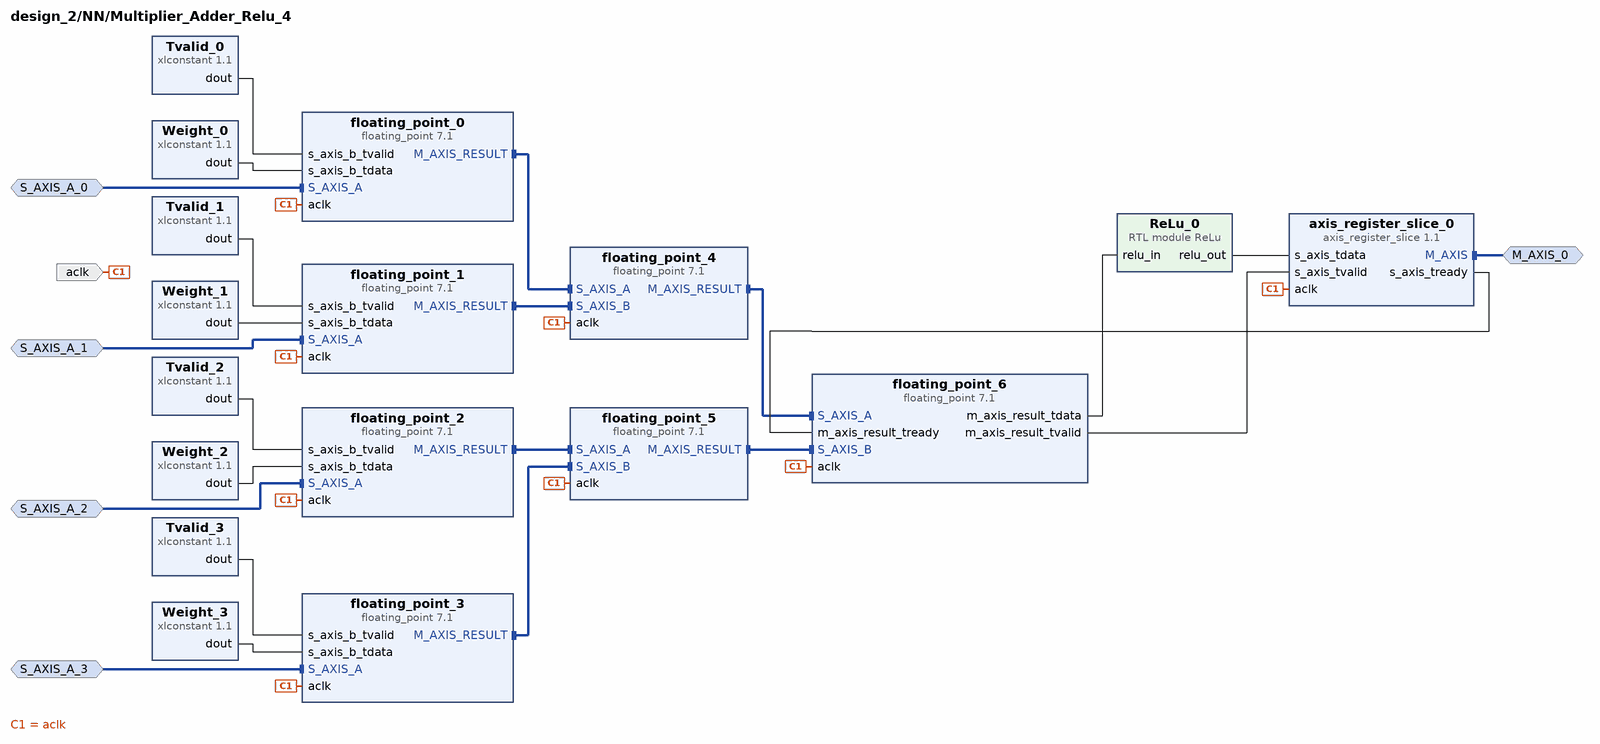
[diagram p7: block diagram inside /NN/Multiplier_Adder_Relu_4]
create_bd_intf_pin -mode Master -vlnv xilinx.com:interface:axis_rtl:1.0 M_AXIS_0
create_bd_intf_pin -mode Slave -vlnv xilinx.com:interface:axis_rtl:1.0 S_AXIS_A_0
create_bd_intf_pin -mode Slave -vlnv xilinx.com:interface:axis_rtl:1.0 S_AXIS_A_1
create_bd_intf_pin -mode Slave -vlnv xilinx.com:interface:axis_rtl:1.0 S_AXIS_A_2
create_bd_intf_pin -mode Slave -vlnv xilinx.com:interface:axis_rtl:1.0 S_AXIS_A_3
create_bd_pin -dir I -type clk aclk

create_bd_cell -type ip -vlnv xilinx.com:ip:floating_point:7.1 floating_point_2
set_property -dict [list \
  CONFIG.C_Latency 9 \
  CONFIG.C_Mult_Usage Full_Usage \
  CONFIG.C_Rate 1 \
  CONFIG.C_Result_Exponent_Width 8 \
  CONFIG.C_Result_Fraction_Width 24 \
  CONFIG.Maximum_Latency true \
  CONFIG.Operation_Type Multiply \
  CONFIG.Result_Precision_Type Single \
] [get_bd_cells floating_point_2]
create_bd_cell -type ip -vlnv xilinx.com:ip:floating_point:7.1 floating_point_3
set_property -dict [list \
  CONFIG.C_Latency 9 \
  CONFIG.C_Mult_Usage Full_Usage \
  CONFIG.C_Rate 1 \
  CONFIG.C_Result_Exponent_Width 8 \
  CONFIG.C_Result_Fraction_Width 24 \
  CONFIG.Maximum_Latency true \
  CONFIG.Operation_Type Multiply \
  CONFIG.Result_Precision_Type Single \
] [get_bd_cells floating_point_3]
create_bd_cell -type ip -vlnv xilinx.com:ip:floating_point:7.1 floating_point_0
set_property -dict [list \
  CONFIG.C_Latency 9 \
  CONFIG.C_Mult_Usage Full_Usage \
  CONFIG.C_Rate 1 \
  CONFIG.C_Result_Exponent_Width 8 \
  CONFIG.C_Result_Fraction_Width 24 \
  CONFIG.Has_ARESETn false \
  CONFIG.Has_B_TLAST false \
  CONFIG.Maximum_Latency true \
  CONFIG.Operation_Type Multiply \
  CONFIG.RESULT_TLAST_Behv Null \
  CONFIG.Result_Precision_Type Single \
] [get_bd_cells floating_point_0]
create_bd_cell -type ip -vlnv xilinx.com:ip:floating_point:7.1 floating_point_1
set_property -dict [list \
  CONFIG.C_Latency 9 \
  CONFIG.C_Mult_Usage Full_Usage \
  CONFIG.C_Rate 1 \
  CONFIG.C_Result_Exponent_Width 8 \
  CONFIG.C_Result_Fraction_Width 24 \
  CONFIG.Maximum_Latency true \
  CONFIG.Operation_Type Multiply \
  CONFIG.Result_Precision_Type Single \
] [get_bd_cells floating_point_1]
create_bd_cell -type ip -vlnv xilinx.com:ip:floating_point:7.1 floating_point_4
set_property -dict [list \
  CONFIG.Add_Sub_Value Add \
  CONFIG.C_Latency 12 \
  CONFIG.C_Mult_Usage Full_Usage \
  CONFIG.C_Rate 1 \
  CONFIG.C_Result_Exponent_Width 8 \
  CONFIG.C_Result_Fraction_Width 24 \
  CONFIG.Maximum_Latency true \
  CONFIG.Operation_Type Add_Subtract \
  CONFIG.Result_Precision_Type Single \
] [get_bd_cells floating_point_4]
create_bd_cell -type ip -vlnv xilinx.com:ip:floating_point:7.1 floating_point_5
set_property -dict [list \
  CONFIG.Add_Sub_Value Add \
  CONFIG.C_Latency 12 \
  CONFIG.C_Mult_Usage Full_Usage \
  CONFIG.C_Rate 1 \
  CONFIG.C_Result_Exponent_Width 8 \
  CONFIG.C_Result_Fraction_Width 24 \
  CONFIG.Maximum_Latency true \
  CONFIG.Operation_Type Add_Subtract \
  CONFIG.Result_Precision_Type Single \
] [get_bd_cells floating_point_5]
create_bd_cell -type ip -vlnv xilinx.com:ip:floating_point:7.1 floating_point_6
set_property -dict [list \
  CONFIG.Add_Sub_Value Add \
  CONFIG.C_Latency 12 \
  CONFIG.C_Mult_Usage Full_Usage \
  CONFIG.C_Rate 1 \
  CONFIG.C_Result_Exponent_Width 8 \
  CONFIG.C_Result_Fraction_Width 24 \
  CONFIG.Maximum_Latency true \
  CONFIG.Operation_Type Add_Subtract \
  CONFIG.Result_Precision_Type Single \
] [get_bd_cells floating_point_6]
create_bd_cell -type ip -vlnv xilinx.com:ip:xlconstant:1.1 Weight_0
set_property -dict {CONFIG.CONST_VAL b10111101101000101100111011011000 CONFIG.CONST_WIDTH 32} [get_bd_cells Weight_0]
create_bd_cell -type ip -vlnv xilinx.com:ip:xlconstant:1.1 Weight_1
set_property -dict {CONFIG.CONST_VAL b10111110010111100011001000001000 CONFIG.CONST_WIDTH 32} [get_bd_cells Weight_1]
create_bd_cell -type ip -vlnv xilinx.com:ip:xlconstant:1.1 Weight_2
set_property -dict {CONFIG.CONST_VAL b10111110100000110110011001110110 CONFIG.CONST_WIDTH 32} [get_bd_cells Weight_2]
create_bd_cell -type ip -vlnv xilinx.com:ip:xlconstant:1.1 Weight_3
set_property -dict {CONFIG.CONST_VAL b10111110011101110111000101000000 CONFIG.CONST_WIDTH 32} [get_bd_cells Weight_3]
create_bd_cell -type ip -vlnv xilinx.com:ip:axis_register_slice:1.1 axis_register_slice_0
set_property -dict {CONFIG.TDATA_NUM_BYTES 4} [get_bd_cells axis_register_slice_0]
create_bd_cell -type ip -vlnv xilinx.com:ip:xlconstant:1.1 Tvalid_0
set_property -dict {CONFIG.CONST_WIDTH 1} [get_bd_cells Tvalid_0]
create_bd_cell -type ip -vlnv xilinx.com:ip:xlconstant:1.1 Tvalid_1
set_property -dict {CONFIG.CONST_WIDTH 1} [get_bd_cells Tvalid_1]
create_bd_cell -type ip -vlnv xilinx.com:ip:xlconstant:1.1 Tvalid_2
set_property -dict {CONFIG.CONST_WIDTH 1} [get_bd_cells Tvalid_2]
create_bd_cell -type ip -vlnv xilinx.com:ip:xlconstant:1.1 Tvalid_3
set_property -dict {CONFIG.CONST_WIDTH 1} [get_bd_cells Tvalid_3]
create_bd_cell -type module -reference ReLu ReLu_0

# ---- hierarchy /NN/Multiplier_Adder_Relu_5 ----
current_bd_instance /NN/Multiplier_Adder_Relu_5
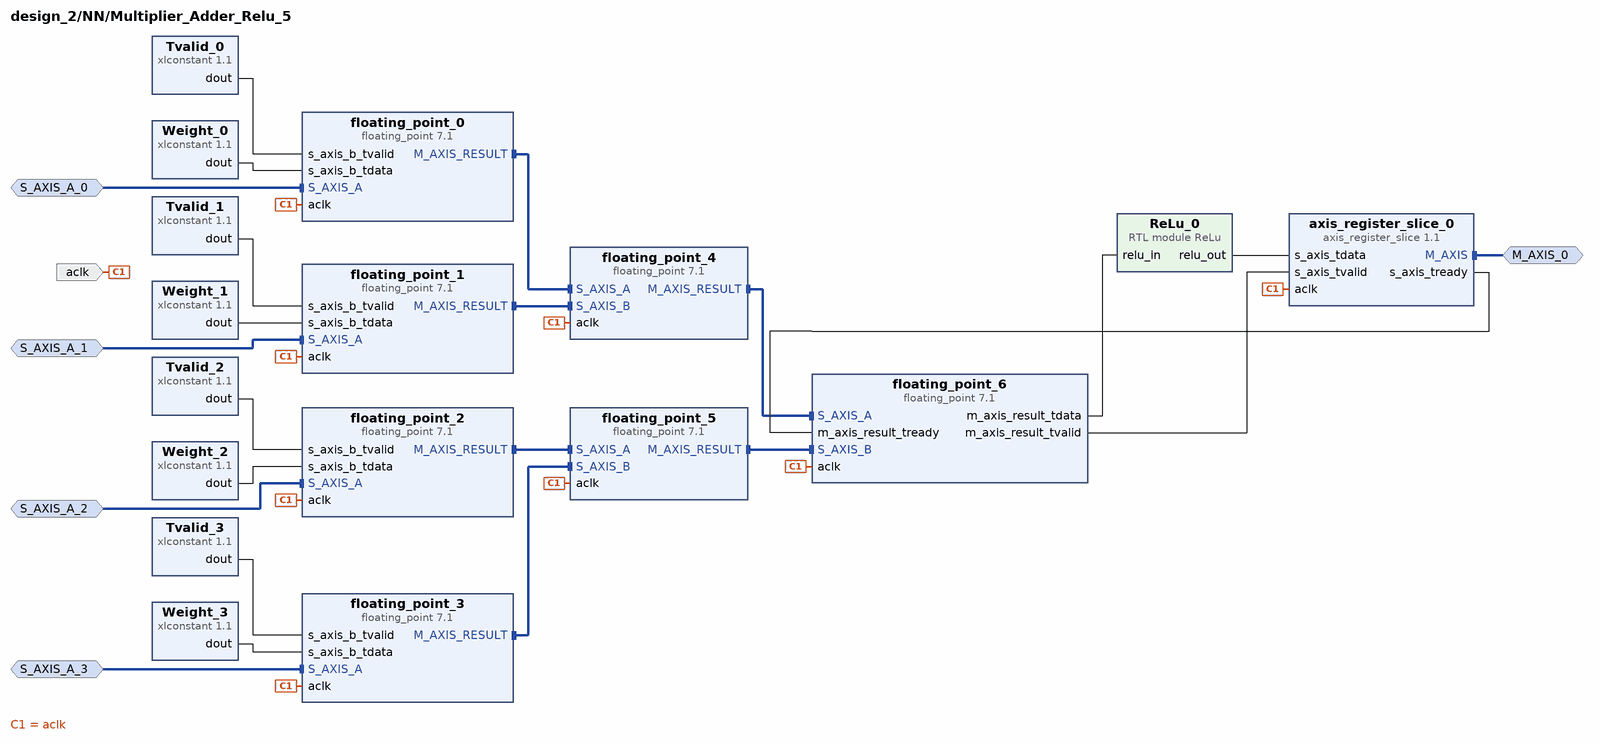
[diagram p8: block diagram inside /NN/Multiplier_Adder_Relu_5]
create_bd_intf_pin -mode Master -vlnv xilinx.com:interface:axis_rtl:1.0 M_AXIS_0
create_bd_intf_pin -mode Slave -vlnv xilinx.com:interface:axis_rtl:1.0 S_AXIS_A_0
create_bd_intf_pin -mode Slave -vlnv xilinx.com:interface:axis_rtl:1.0 S_AXIS_A_1
create_bd_intf_pin -mode Slave -vlnv xilinx.com:interface:axis_rtl:1.0 S_AXIS_A_2
create_bd_intf_pin -mode Slave -vlnv xilinx.com:interface:axis_rtl:1.0 S_AXIS_A_3
create_bd_pin -dir I -type clk aclk

create_bd_cell -type ip -vlnv xilinx.com:ip:floating_point:7.1 floating_point_2
set_property -dict [list \
  CONFIG.C_Latency 9 \
  CONFIG.C_Mult_Usage Full_Usage \
  CONFIG.C_Rate 1 \
  CONFIG.C_Result_Exponent_Width 8 \
  CONFIG.C_Result_Fraction_Width 24 \
  CONFIG.Maximum_Latency true \
  CONFIG.Operation_Type Multiply \
  CONFIG.Result_Precision_Type Single \
] [get_bd_cells floating_point_2]
create_bd_cell -type ip -vlnv xilinx.com:ip:floating_point:7.1 floating_point_3
set_property -dict [list \
  CONFIG.C_Latency 9 \
  CONFIG.C_Mult_Usage Full_Usage \
  CONFIG.C_Rate 1 \
  CONFIG.C_Result_Exponent_Width 8 \
  CONFIG.C_Result_Fraction_Width 24 \
  CONFIG.Maximum_Latency true \
  CONFIG.Operation_Type Multiply \
  CONFIG.Result_Precision_Type Single \
] [get_bd_cells floating_point_3]
create_bd_cell -type ip -vlnv xilinx.com:ip:floating_point:7.1 floating_point_0
set_property -dict [list \
  CONFIG.C_Latency 9 \
  CONFIG.C_Mult_Usage Full_Usage \
  CONFIG.C_Rate 1 \
  CONFIG.C_Result_Exponent_Width 8 \
  CONFIG.C_Result_Fraction_Width 24 \
  CONFIG.Has_ARESETn false \
  CONFIG.Has_B_TLAST false \
  CONFIG.Maximum_Latency true \
  CONFIG.Operation_Type Multiply \
  CONFIG.RESULT_TLAST_Behv Null \
  CONFIG.Result_Precision_Type Single \
] [get_bd_cells floating_point_0]
create_bd_cell -type ip -vlnv xilinx.com:ip:floating_point:7.1 floating_point_1
set_property -dict [list \
  CONFIG.C_Latency 9 \
  CONFIG.C_Mult_Usage Full_Usage \
  CONFIG.C_Rate 1 \
  CONFIG.C_Result_Exponent_Width 8 \
  CONFIG.C_Result_Fraction_Width 24 \
  CONFIG.Maximum_Latency true \
  CONFIG.Operation_Type Multiply \
  CONFIG.Result_Precision_Type Single \
] [get_bd_cells floating_point_1]
create_bd_cell -type ip -vlnv xilinx.com:ip:floating_point:7.1 floating_point_4
set_property -dict [list \
  CONFIG.Add_Sub_Value Add \
  CONFIG.C_Latency 12 \
  CONFIG.C_Mult_Usage Full_Usage \
  CONFIG.C_Rate 1 \
  CONFIG.C_Result_Exponent_Width 8 \
  CONFIG.C_Result_Fraction_Width 24 \
  CONFIG.Maximum_Latency true \
  CONFIG.Operation_Type Add_Subtract \
  CONFIG.Result_Precision_Type Single \
] [get_bd_cells floating_point_4]
create_bd_cell -type ip -vlnv xilinx.com:ip:floating_point:7.1 floating_point_5
set_property -dict [list \
  CONFIG.Add_Sub_Value Add \
  CONFIG.C_Latency 12 \
  CONFIG.C_Mult_Usage Full_Usage \
  CONFIG.C_Rate 1 \
  CONFIG.C_Result_Exponent_Width 8 \
  CONFIG.C_Result_Fraction_Width 24 \
  CONFIG.Maximum_Latency true \
  CONFIG.Operation_Type Add_Subtract \
  CONFIG.Result_Precision_Type Single \
] [get_bd_cells floating_point_5]
create_bd_cell -type ip -vlnv xilinx.com:ip:floating_point:7.1 floating_point_6
set_property -dict [list \
  CONFIG.Add_Sub_Value Add \
  CONFIG.C_Latency 12 \
  CONFIG.C_Mult_Usage Full_Usage \
  CONFIG.C_Rate 1 \
  CONFIG.C_Result_Exponent_Width 8 \
  CONFIG.C_Result_Fraction_Width 24 \
  CONFIG.Maximum_Latency true \
  CONFIG.Operation_Type Add_Subtract \
  CONFIG.Result_Precision_Type Single \
] [get_bd_cells floating_point_6]
create_bd_cell -type ip -vlnv xilinx.com:ip:xlconstant:1.1 Weight_0
set_property -dict {CONFIG.CONST_VAL b10111111100010000010101111111010 CONFIG.CONST_WIDTH 32} [get_bd_cells Weight_0]
create_bd_cell -type ip -vlnv xilinx.com:ip:xlconstant:1.1 Weight_1
set_property -dict {CONFIG.CONST_VAL b00111111000000110010100101100010 CONFIG.CONST_WIDTH 32} [get_bd_cells Weight_1]
create_bd_cell -type ip -vlnv xilinx.com:ip:xlconstant:1.1 Weight_2
set_property -dict {CONFIG.CONST_VAL b10111101110010010011001001101000 CONFIG.CONST_WIDTH 32} [get_bd_cells Weight_2]
create_bd_cell -type ip -vlnv xilinx.com:ip:xlconstant:1.1 Weight_3
set_property -dict {CONFIG.CONST_VAL b10111110110010111010100011010111 CONFIG.CONST_WIDTH 32} [get_bd_cells Weight_3]
create_bd_cell -type ip -vlnv xilinx.com:ip:axis_register_slice:1.1 axis_register_slice_0
set_property -dict {CONFIG.TDATA_NUM_BYTES 4} [get_bd_cells axis_register_slice_0]
create_bd_cell -type ip -vlnv xilinx.com:ip:xlconstant:1.1 Tvalid_0
set_property -dict {CONFIG.CONST_WIDTH 1} [get_bd_cells Tvalid_0]
create_bd_cell -type ip -vlnv xilinx.com:ip:xlconstant:1.1 Tvalid_1
set_property -dict {CONFIG.CONST_WIDTH 1} [get_bd_cells Tvalid_1]
create_bd_cell -type ip -vlnv xilinx.com:ip:xlconstant:1.1 Tvalid_2
set_property -dict {CONFIG.CONST_WIDTH 1} [get_bd_cells Tvalid_2]
create_bd_cell -type ip -vlnv xilinx.com:ip:xlconstant:1.1 Tvalid_3
set_property -dict {CONFIG.CONST_WIDTH 1} [get_bd_cells Tvalid_3]
create_bd_cell -type module -reference ReLu ReLu_0

# ---- hierarchy /NN/Multiplier_Adder_Relu_6 ----
current_bd_instance /NN/Multiplier_Adder_Relu_6
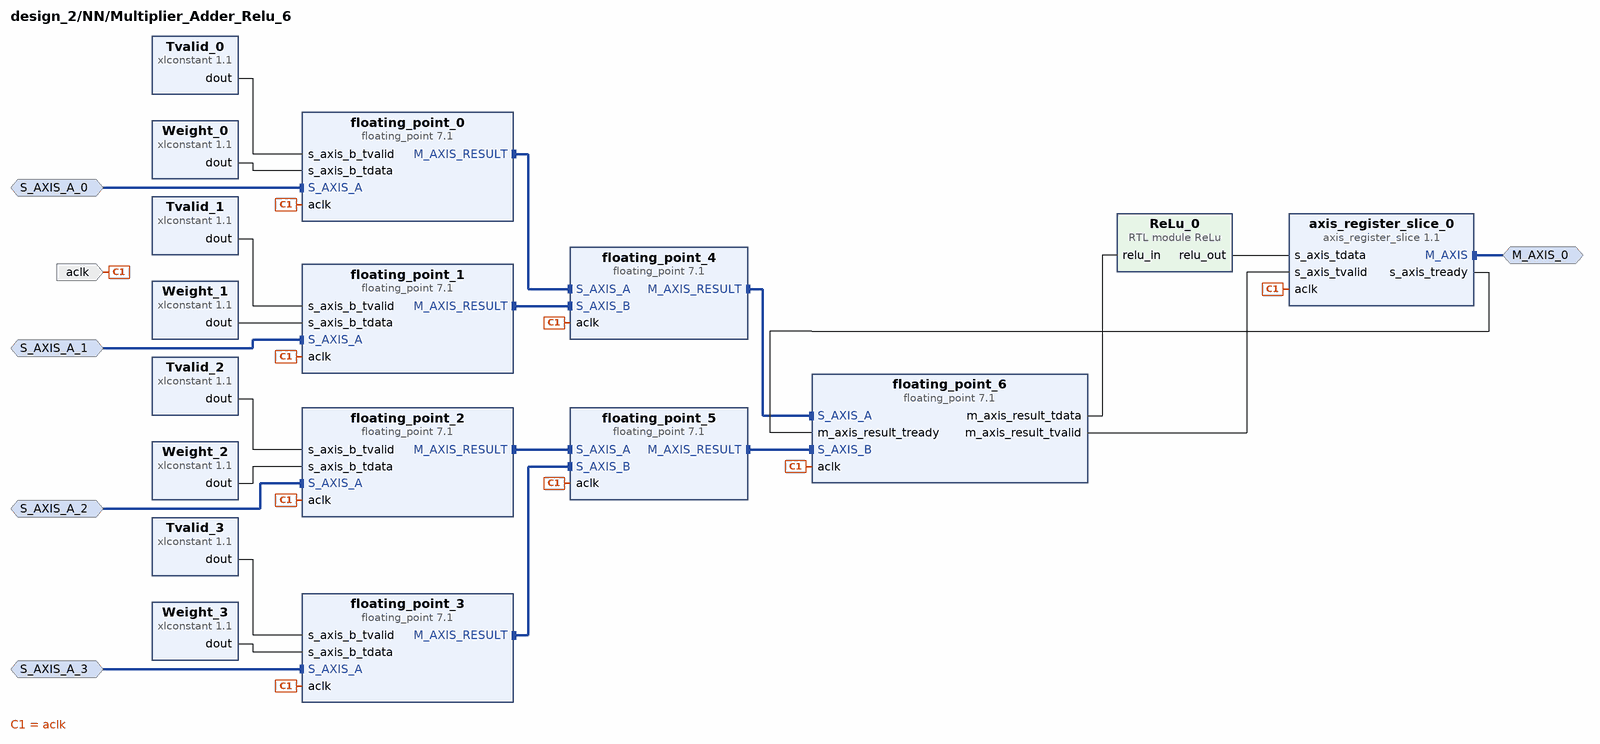
[diagram p9: block diagram inside /NN/Multiplier_Adder_Relu_6]
create_bd_intf_pin -mode Master -vlnv xilinx.com:interface:axis_rtl:1.0 M_AXIS_0
create_bd_intf_pin -mode Slave -vlnv xilinx.com:interface:axis_rtl:1.0 S_AXIS_A_0
create_bd_intf_pin -mode Slave -vlnv xilinx.com:interface:axis_rtl:1.0 S_AXIS_A_1
create_bd_intf_pin -mode Slave -vlnv xilinx.com:interface:axis_rtl:1.0 S_AXIS_A_2
create_bd_intf_pin -mode Slave -vlnv xilinx.com:interface:axis_rtl:1.0 S_AXIS_A_3
create_bd_pin -dir I -type clk aclk

create_bd_cell -type ip -vlnv xilinx.com:ip:floating_point:7.1 floating_point_2
set_property -dict [list \
  CONFIG.C_Latency 9 \
  CONFIG.C_Mult_Usage Full_Usage \
  CONFIG.C_Rate 1 \
  CONFIG.C_Result_Exponent_Width 8 \
  CONFIG.C_Result_Fraction_Width 24 \
  CONFIG.Maximum_Latency true \
  CONFIG.Operation_Type Multiply \
  CONFIG.Result_Precision_Type Single \
] [get_bd_cells floating_point_2]
create_bd_cell -type ip -vlnv xilinx.com:ip:floating_point:7.1 floating_point_3
set_property -dict [list \
  CONFIG.C_Latency 9 \
  CONFIG.C_Mult_Usage Full_Usage \
  CONFIG.C_Rate 1 \
  CONFIG.C_Result_Exponent_Width 8 \
  CONFIG.C_Result_Fraction_Width 24 \
  CONFIG.Maximum_Latency true \
  CONFIG.Operation_Type Multiply \
  CONFIG.Result_Precision_Type Single \
] [get_bd_cells floating_point_3]
create_bd_cell -type ip -vlnv xilinx.com:ip:floating_point:7.1 floating_point_0
set_property -dict [list \
  CONFIG.C_Latency 9 \
  CONFIG.C_Mult_Usage Full_Usage \
  CONFIG.C_Rate 1 \
  CONFIG.C_Result_Exponent_Width 8 \
  CONFIG.C_Result_Fraction_Width 24 \
  CONFIG.Has_ARESETn false \
  CONFIG.Has_B_TLAST false \
  CONFIG.Maximum_Latency true \
  CONFIG.Operation_Type Multiply \
  CONFIG.RESULT_TLAST_Behv Null \
  CONFIG.Result_Precision_Type Single \
] [get_bd_cells floating_point_0]
create_bd_cell -type ip -vlnv xilinx.com:ip:floating_point:7.1 floating_point_1
set_property -dict [list \
  CONFIG.C_Latency 9 \
  CONFIG.C_Mult_Usage Full_Usage \
  CONFIG.C_Rate 1 \
  CONFIG.C_Result_Exponent_Width 8 \
  CONFIG.C_Result_Fraction_Width 24 \
  CONFIG.Maximum_Latency true \
  CONFIG.Operation_Type Multiply \
  CONFIG.Result_Precision_Type Single \
] [get_bd_cells floating_point_1]
create_bd_cell -type ip -vlnv xilinx.com:ip:floating_point:7.1 floating_point_4
set_property -dict [list \
  CONFIG.Add_Sub_Value Add \
  CONFIG.C_Latency 12 \
  CONFIG.C_Mult_Usage Full_Usage \
  CONFIG.C_Rate 1 \
  CONFIG.C_Result_Exponent_Width 8 \
  CONFIG.C_Result_Fraction_Width 24 \
  CONFIG.Maximum_Latency true \
  CONFIG.Operation_Type Add_Subtract \
  CONFIG.Result_Precision_Type Single \
] [get_bd_cells floating_point_4]
create_bd_cell -type ip -vlnv xilinx.com:ip:floating_point:7.1 floating_point_5
set_property -dict [list \
  CONFIG.Add_Sub_Value Add \
  CONFIG.C_Latency 12 \
  CONFIG.C_Mult_Usage Full_Usage \
  CONFIG.C_Rate 1 \
  CONFIG.C_Result_Exponent_Width 8 \
  CONFIG.C_Result_Fraction_Width 24 \
  CONFIG.Maximum_Latency true \
  CONFIG.Operation_Type Add_Subtract \
  CONFIG.Result_Precision_Type Single \
] [get_bd_cells floating_point_5]
create_bd_cell -type ip -vlnv xilinx.com:ip:floating_point:7.1 floating_point_6
set_property -dict [list \
  CONFIG.Add_Sub_Value Add \
  CONFIG.C_Latency 12 \
  CONFIG.C_Mult_Usage Full_Usage \
  CONFIG.C_Rate 1 \
  CONFIG.C_Result_Exponent_Width 8 \
  CONFIG.C_Result_Fraction_Width 24 \
  CONFIG.Maximum_Latency true \
  CONFIG.Operation_Type Add_Subtract \
  CONFIG.Result_Precision_Type Single \
] [get_bd_cells floating_point_6]
create_bd_cell -type ip -vlnv xilinx.com:ip:xlconstant:1.1 Weight_0
set_property -dict {CONFIG.CONST_VAL b00111110101111000010010001001101 CONFIG.CONST_WIDTH 32} [get_bd_cells Weight_0]
create_bd_cell -type ip -vlnv xilinx.com:ip:xlconstant:1.1 Weight_1
set_property -dict {CONFIG.CONST_VAL b11000000011100110000111001110000 CONFIG.CONST_WIDTH 32} [get_bd_cells Weight_1]
create_bd_cell -type ip -vlnv xilinx.com:ip:xlconstant:1.1 Weight_2
set_property -dict {CONFIG.CONST_VAL b10111101001010111101010110111010 CONFIG.CONST_WIDTH 32} [get_bd_cells Weight_2]
create_bd_cell -type ip -vlnv xilinx.com:ip:xlconstant:1.1 Weight_3
set_property -dict {CONFIG.CONST_VAL b00111110101110111010111100101100 CONFIG.CONST_WIDTH 32} [get_bd_cells Weight_3]
create_bd_cell -type ip -vlnv xilinx.com:ip:axis_register_slice:1.1 axis_register_slice_0
set_property -dict {CONFIG.TDATA_NUM_BYTES 4} [get_bd_cells axis_register_slice_0]
create_bd_cell -type ip -vlnv xilinx.com:ip:xlconstant:1.1 Tvalid_0
set_property -dict {CONFIG.CONST_WIDTH 1} [get_bd_cells Tvalid_0]
create_bd_cell -type ip -vlnv xilinx.com:ip:xlconstant:1.1 Tvalid_1
set_property -dict {CONFIG.CONST_WIDTH 1} [get_bd_cells Tvalid_1]
create_bd_cell -type ip -vlnv xilinx.com:ip:xlconstant:1.1 Tvalid_2
set_property -dict {CONFIG.CONST_WIDTH 1} [get_bd_cells Tvalid_2]
create_bd_cell -type ip -vlnv xilinx.com:ip:xlconstant:1.1 Tvalid_3
set_property -dict {CONFIG.CONST_WIDTH 1} [get_bd_cells Tvalid_3]
create_bd_cell -type module -reference ReLu ReLu_0
